# EAGLE design Atlas (EAGLE 9.2.2)
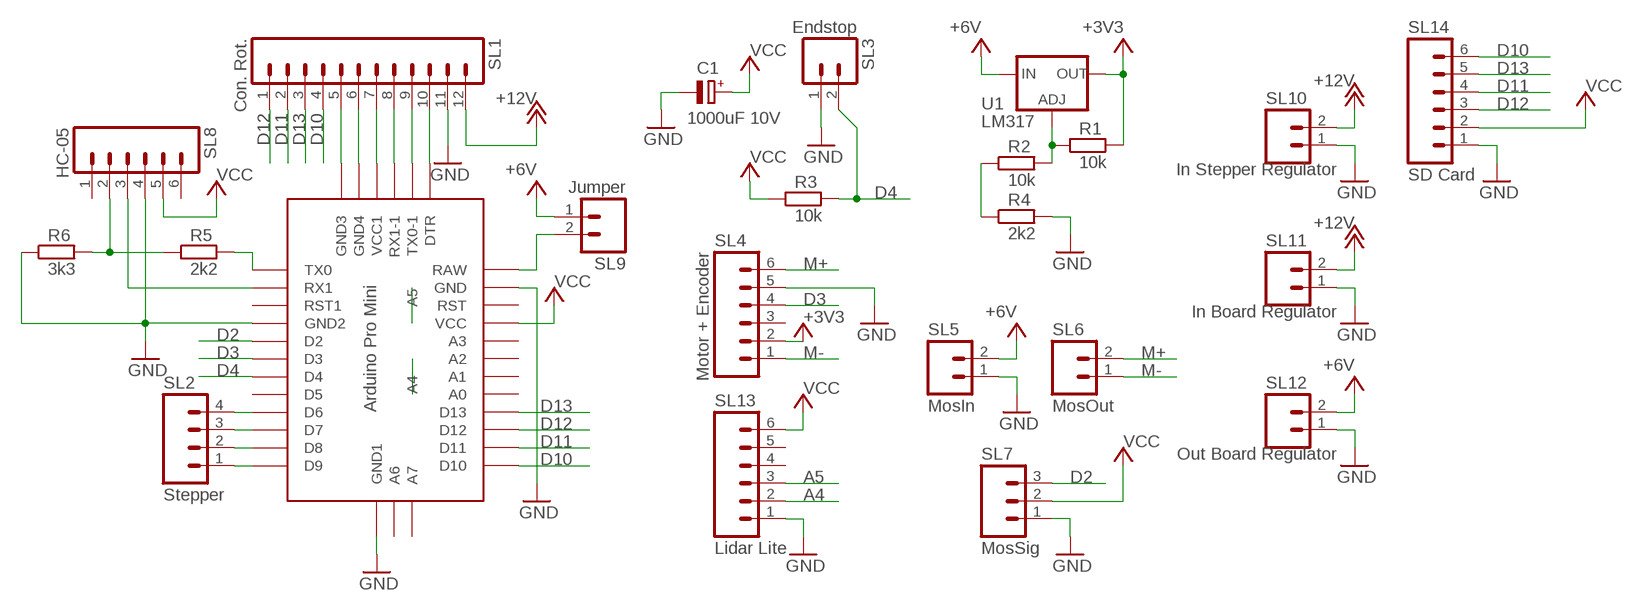
[diagram p0: schematic, sheet 1]

## Parts
C1  1000uF 10V  CPOL-EUE5-10.5  [E5-10,5]
R1  10k  R-EU_0207/10  [0207/10]
R2  10k  R-EU_0207/10  [0207/10]
R3  10k  R-EU_0207/10  [0207/10]
R4  2k2  R-EU_0207/10  [0207/10]
R5  2k2  R-EU_0207/10  [0207/10]
R6  3k3  R-EU_0207/10  [0207/10]
SL1  Con. Rot.  M12  [12P]
SL2  Stepper  M04  [04P]
SL3  Endstop  M02  [02P]
SL4  Motor + Encoder  M06  [06P]
SL5  MosIn  M02  [02P]
SL6  MosOut  M02  [02P]
SL7  MosSig  M03  [03P]
SL8  HC-05  M06  [06P]
SL9  Jumper  M02  [02P]
SL10  In Stepper Regulator  M02  [02P]
SL11  In Board Regulator  M02  [02P]
SL12  Out Board Regulator  M02  [02P]
SL13  Lidar Lite  M06  [06P]
SL14  SD Card  M06  [06P]
U1  LM317  V_REG_317SINK  [TO220-ADJ]
U$1  ABK-PRO-MINI  [ABK-PRO-MINI]

## Nets
+3V3: R1.2 SL4.2 U1.OUT
+6V: SL5.2 SL9.1 SL12.2 U1.IN
+12V: SL1.12 SL10.2 SL11.2
A4: SL13.2 U$1.A4
A5: SL13.3 U$1.A5
D2: SL7.3 U$1.D2
D3: SL4.4 U$1.D3
D4: R3.2 SL3.2 U$1.D4
D10: SL1.4 SL14.6 U$1.D10
D11: SL1.2 SL14.4 U$1.D11
D12: SL1.1 SL14.3 U$1.D12
D13: SL1.3 SL14.5 U$1.D13
DTR: SL1.10 U$1.DTR
GND: C1.- R4.2 R6.1 SL1.5 SL1.6 SL1.11 SL3.1 SL4.5 SL5.1 SL7.1 SL8.4 SL10.1 SL11.1 SL12.1 SL13.1 SL14.1 U$1.GND U$1.GND1(GND2) U$1.GND2(GND3) U$1.GND3(GND4) U$1.GND4(GND1)
M+: SL4.6 SL6.2
M-: SL4.1 SL6.1
N$1: R5.2 U$1.TX0
N$2: SL9.2 U$1.RAW
N$7: R2.1 R4.1
N$8: R5.1 R6.2 SL8.2
N$9: R1.1 R2.2 U1.ADJ
N$10: SL8.3 U$1.RX1
N$12: SL2.1 U$1.D9
N$13: SL2.2 U$1.D8
N$14: SL2.3 U$1.D7
N$15: SL2.4 U$1.D6
RX1: SL1.8 U$1.RX1-1
TX0: SL1.9 U$1.TX0-1
VCC: C1.+ R3.1 SL1.7 SL7.2 SL8.5 SL13.6 SL14.2 U$1.VCC U$1.VCC1
Unconnected: SL4.3 SL8.1 SL8.6 SL13.4 SL13.5 U$1.A0 U$1.A1 U$1.A2 U$1.A3 U$1.A6 U$1.A7 U$1.D5 U$1.RST U$1.RST1

## Library data of the parts
C1 = resistor:CPOL-EU: POLARIZED CAPACITOR, European symbol
R1-R6 = resistor:R-EU_: RESISTOR, European symbol
SL1 = con-amp-quick:M12: AMP QUICK CONNECTOR; OC_FARNELL: unknown; OC_NEWARK: unknown
SL2 = con-amp-quick:M04: AMP QUICK CONNECTOR; OC_FARNELL: unknown; OC_NEWARK: unknown
SL3 SL5 SL6 SL9-SL12 = con-amp-quick:M02: AMP QUICK CONNECTOR; OC_FARNELL: unknown; OC_NEWARK: unknown
SL4 SL8 SL13 SL14 = con-amp-quick:M06: AMP QUICK CONNECTOR; OC_FARNELL: unknown; OC_NEWARK: unknown
SL7 = con-amp-quick:M03: AMP QUICK CONNECTOR; OC_FARNELL: unknown; OC_NEWARK: unknown
U1 = SparkFun-IC-Power:V_REG_317: Voltage Regulator Standard LM317 adjustable voltage regulator. AOI (Adjust Output Input). Google 'LM317 Calculator' for easy to use app to get the two resistor values needed. 240/720 for 5V output. 240/390 for 3.3V output. Spark Fun Electronics SKU : COM-00527
U$1 = Arduino:ABK-PRO-MINI: ABK Pro-Mini Arduino Clone

## Board
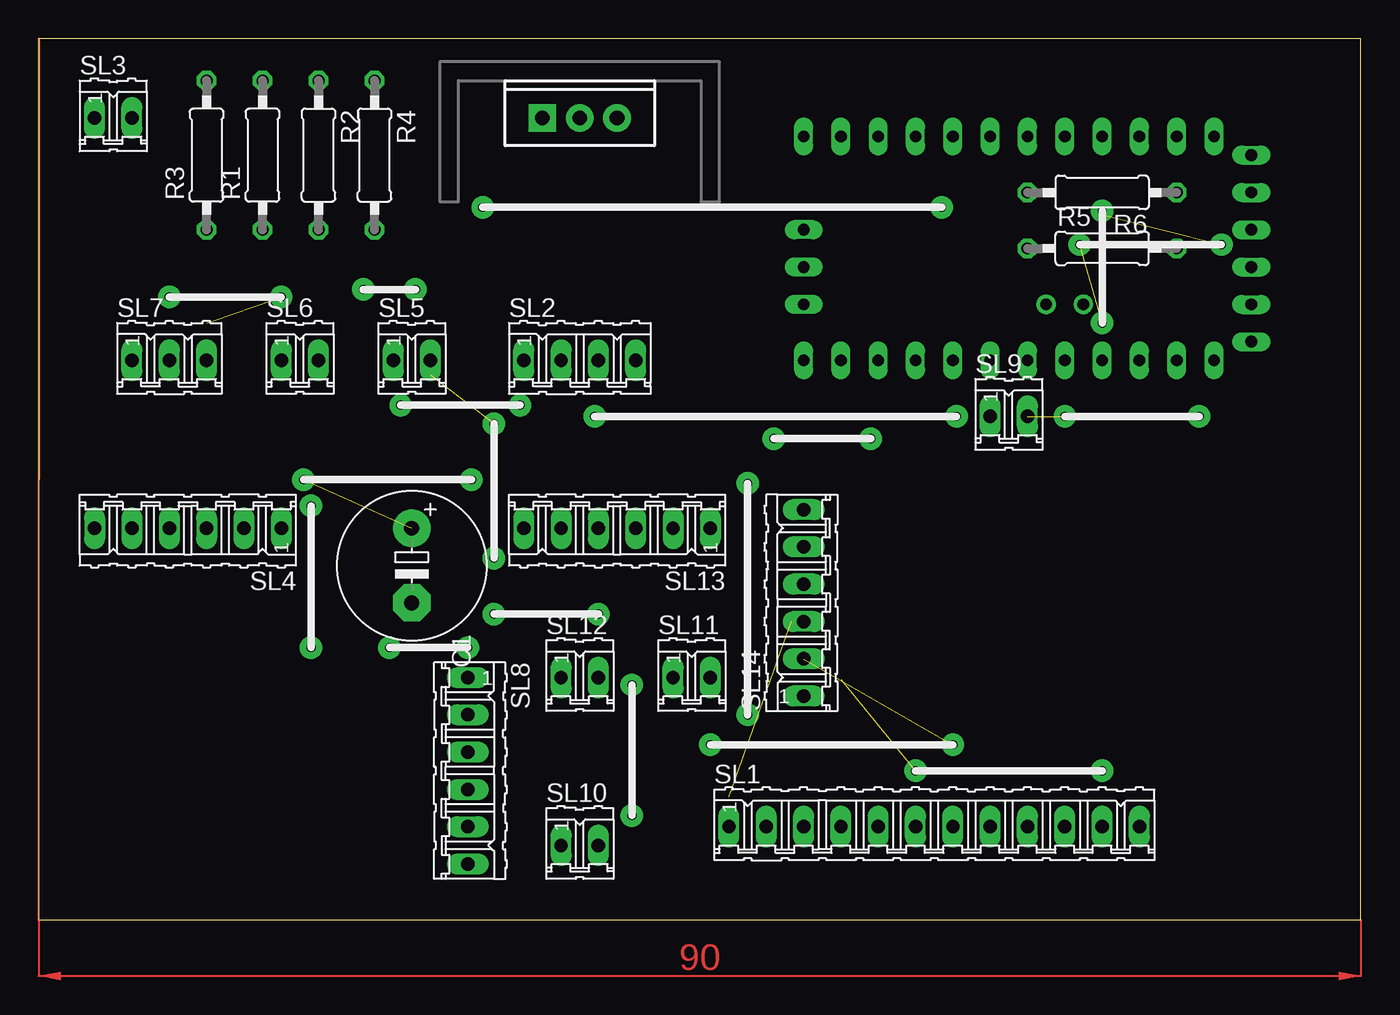
[diagram p1: board, top side]
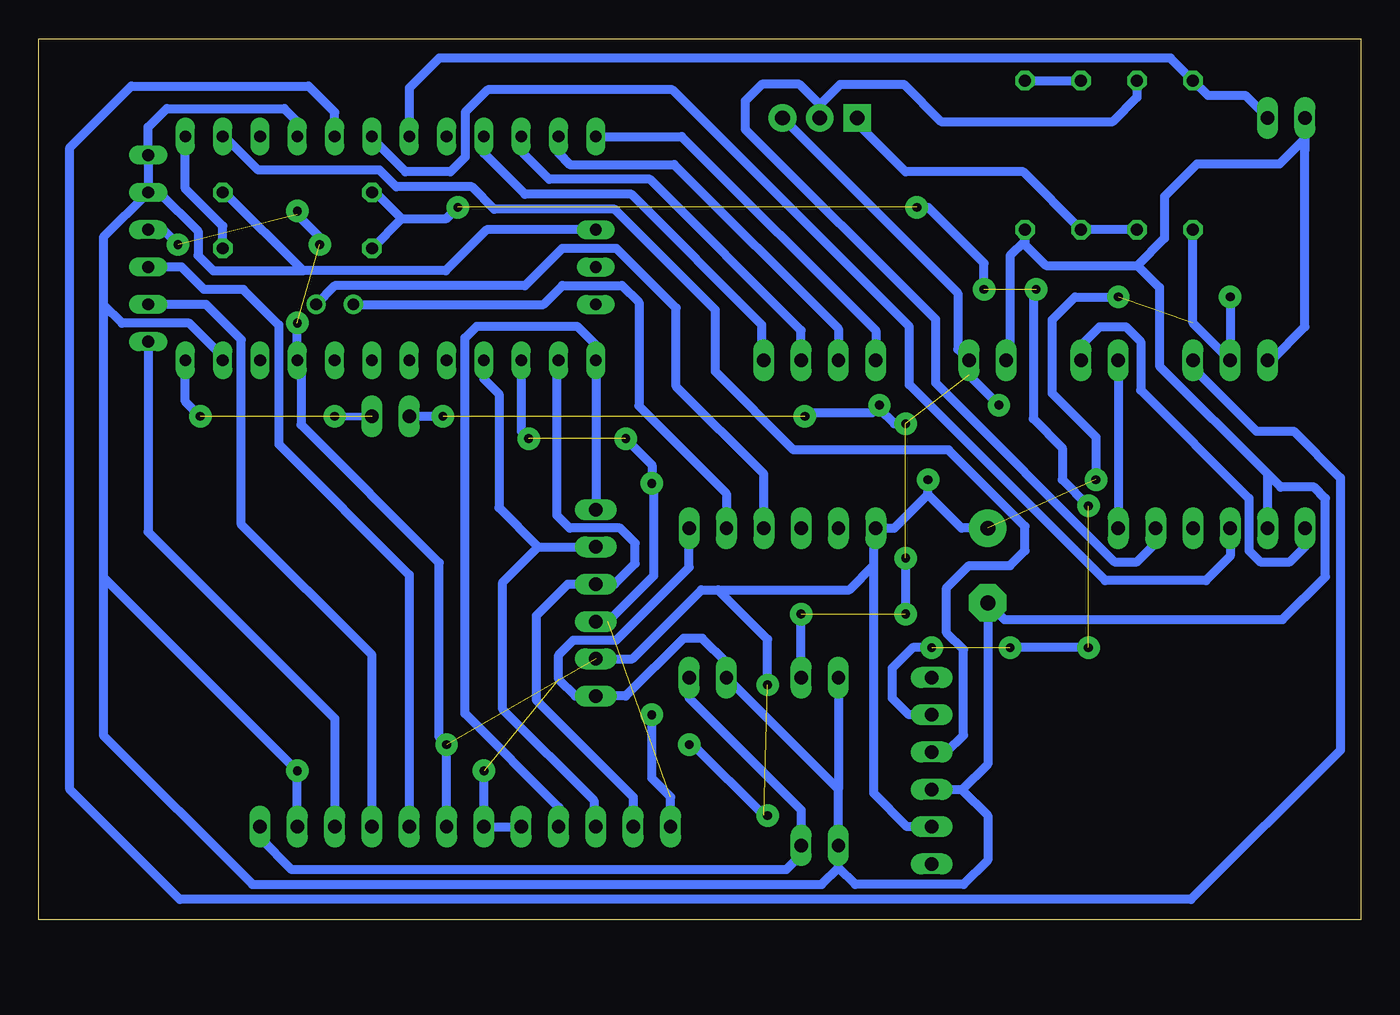
[diagram p2: board, bottom side, seen from below]

Size 90 x 60 mm. Coordinates in mm from the lower left corner, seen from the top.
Outline: 0,0 90,0 90,60 0,60 0,0
Copper layers (1*16): Top 0.035mm / dielectric 1.5mm / Bottom 0.035mm
Design rules "default *": minimum track width 20mil, minimum drill 0.35mm, track to track 10mil, track to pad 10mil, pad to pad 10mil, via to via 10mil, smd to smd 10mil, copper to edge 40mil, drill to drill 6mil, minimum pad ring 10mil, minimum via ring 8mil, stop-mask expansion 4mil, vias tented up to drill 0mil, thermal gap 10mil

### Footprints (pad centres in the part's own frame; a part is rotated, then mirrored left to right if it is on the bottom)
E5-10,5 = drill 1.016 pad 2.54: + -2.54,0 | drill 1.016 pad 2.54 octagon: - 2.54,0
0207/10 = drill 0.813 octagon: 1 -5.08,0; 2 5.08,0
12P = drill 0.914 long: 1 -13.97,0; 2 -11.43,0; 3 -8.89,0; 4 -6.35,0; 5 -3.81,0; 6 -1.27,0; 7 1.27,0; 8 3.81,0; 9 6.35,0; 10 8.89,0; 11 11.43,0; 12 13.97,0
04P = drill 0.914 long: 1 -3.81,0; 2 -1.27,0; 3 1.27,0; 4 3.81,0
02P = drill 0.914 long: 1 -1.27,0; 2 1.27,0
06P = drill 0.914 long: 1 -6.35,0; 2 -3.81,0; 3 -1.27,0; 4 1.27,0; 5 3.81,0; 6 6.35,0
03P = drill 0.914 long: 1 -2.54,0; 2 0,0; 3 2.54,0
TO220-ADJ = drill 1 pad 1.88 square: ADJ -2.54,0 | drill 1 pad 1.88: IN 2.54,0; OUT 0,0
ABK-PRO-MINI = drill 0.8 long: A0 10.16,-3.81; A1 10.16,-6.35; A2 10.16,-8.89; A3 10.16,-11.43; A6 3.81,-21.59; A7 6.35,-21.59; D2 -5.08,-3.81; D3 -5.08,-6.35; D4 -5.08,-8.89; D5 -5.08,-11.43; D6 -5.08,-13.97; D7 -5.08,-16.51; D8 -5.08,-19.05; D9 -5.08,-21.59; D10 10.16,-21.59; D11 10.16,-19.05; D12 10.16,-16.51; D13 10.16,-13.97; DTR 8.89,8.89; GND 10.16,3.81; GND1 -5.08,-1.27; GND2 -3.81,8.89; GND3 -1.27,8.89; GND4 1.27,-21.59; RAW 10.16,6.35; RST 10.16,1.27; RST1 -5.08,1.27; RX1 -5.08,3.81; RX1-1 3.81,8.89; TX0 -5.08,6.35; TX0-1 6.35,8.89; VCC 10.16,-1.27; VCC1 1.27,8.89 | drill 0.8: A4 6.35,-5.08; A5 6.35,-2.54

### Placement (x,y rotation side)
C1  25.4,24.13 270 top
R1  15.24,52.07 90 top
R2  19.05,52.07 270 top
R3  11.43,52.07 90 top
R4  22.86,52.07 270 top
R5  72.39,45.72 0 top
R6  72.39,49.53 180 top
SL1  60.96,6.35 0 top
SL2  36.83,38.1 0 top
SL3  5.08,54.61 0 top
SL4  10.16,26.67 180 top
SL5  25.4,38.1 0 top
SL6  17.78,38.1 0 top
SL7  8.89,38.1 0 top
SL8  29.21,10.16 270 top
SL9  66.04,34.29 0 top
SL10  36.83,5.08 0 top
SL11  44.45,16.51 0 top
SL12  36.83,16.51 0 top
SL13  39.37,26.67 180 top
SL14  52.07,21.59 90 top
U1  36.83,54.61 0 top
U$1  73.66,48.26 270 top

### Tracks (layer width: path | path; a pad name or v marks a point on that pad's centre or on a via)
+3V3
  Bottom 0.61: R1.2 15.24,56.01 16.89,54.36 28.57,54.36 31.11,56.9 35.43,56.9 36.83,55.5 | SL4.2 13.97,25.65 15.24,24.38 16.76,24.38 28.96,36.58 28.96,40.89 41.91,53.85 41.91,55.75 40.77,56.9 38.23,56.9 36.83,55.5 | U1.OUT 36.83,55.5
+6V  (via drill 0.6 pad 1.52)  (4 unrouted)
  Bottom 0.61: U1.IN 27.43,42.67 27.43,38.86 SL5.2 26.67,37.08 v24.64,35.05 | v30.99,33.78 31.75,33.78 32.77,34.8 v32.77,35.05 33.27,34.54 37.59,34.54 v37.85,34.29 | v30.99,24.64 v30.99,20.83 | SL12.2 v38.1,20.83 | v62.48,34.29 SL9.1
+12V
  Bottom 0.61: SL11.2 45.72,15.11 38.1,7.49 SL10.2 38.1,4.45 39.12,3.43 72.77,3.43 74.93,5.59 SL1.12
A4
  Bottom 0.61: U$1.A4 55.64,41.91 54.35,43.2 50.3,43.2 49.15,42.05 49.15,34.99 43.18,29.02 SL13.2
A5
  Bottom 0.61: U$1.A5 69.85,43.18 56.9,43.18 54.36,45.72 50.67,45.72 46.61,41.66 46.61,36.32 40.64,30.35 SL13.3
D2
  Bottom 0.61: U$1.D2 69.85,54.99 71.63,56.77 83.69,56.77 87.88,52.58 87.88,8.89 80.39,1.4 11.56,1.4 1.4,11.56 1.4,30.1 4.57,33.27 7.11,33.27 11.43,37.59 SL7.3
D3
  Bottom 0.61: U$1.D3 67.31,53.21 65.02,50.93 61.98,50.93 60.96,51.94 60.96,54.99 59.44,56.52 46.86,56.52 30.73,40.39 30.73,36.45 17.4,23.11 10.54,23.11 8.89,24.77 SL4.4
D4
  Bottom 0.61: U$1.D4 64.77,56.64 62.74,58.67 12.95,58.67 R3.2 10.41,56.13 7.87,56.13 SL3.2
D10
  Bottom 0.61: SL14.6 U$1.D10 52.07,39.13 53.37,40.42 60.17,40.42 60.98,39.62 60.98,14.05 54.61,7.68 SL1.4
D11
  Bottom 0.61: U$1.D11 54.74,37.97 54.74,27.56 53.85,26.67 50.42,26.67 49.4,25.65 49.4,24.26 50.8,22.86 SL14.4 53.98,22.86 56.13,20.7 56.13,14.99 49.53,8.38 SL1.2
D12  (via drill 0.6 pad 1.52)  (2 unrouted)
  Bottom 0.61: U$1.D12 57.15,33.27 v56.64,32.77 | v50.04,32.77 48.26,30.99 v48.26,29.72 48.13,29.59 48.13,23.43 51.25,20.32 SL14.3 | SL1.1 46.99,8.38 48.26,9.65 v48.26,13.97
D13
  Bottom 0.61: SL1.3 52.2,6.48 52.2,8.13 58.42,14.35 58.42,22.99 56.01,25.4 | U$1.D13 59.69,36.83 58.67,35.81 58.67,28.07 56.01,25.4 | 56.01,25.4 SL14.5
DTR
  Bottom 0.61: SL1.10 69.85,13.72 82.55,26.42 U$1.DTR
GND  (via drill 0.6 pad 1.52)  (1 unrouted)
  Bottom 0.61: 72.01,44.2 77.34,49.53 R6.1 | U$1.GND1 72.39,54.36 73.28,55.24 81.28,55.24 82.55,53.98 U$1.GND2 U$1.GND3 | 85.6,41.9 85.6,46.48 U$1.GND3 | 85.6,41.9 85.6,23.37 | 85.6,23.37 85.6,12.57 75.44,2.41 36.7,2.41 35.56,3.56 | SL3.1 3.81,40.39 6.1,38.1 SL7.1 | SL5.1 23.88,38.35 23.88,45.21 22.86,46.23 R4.2 22.86,45.97 21.44,44.55 15.21,44.55 | 6.35,30.35 13.72,37.72 13.72,43.05 15.21,44.55 | 6.35,30.35 5.46,29.46 3.17,29.46 2.41,28.7 2.41,23.37 5.33,20.45 24.26,20.45 C1.- 25.4,10.61 27.15,8.86 | SL12.1 35.56,8.89 | 35.56,8.89 SL11.1 43.18,17.53 44.83,19.18 46.1,19.18 50.04,15.24 SL14.1 53.47,15.24 54.61,16.38 54.61,18.03 53.59,19.05 50.67,19.05 45.72,24 SL13.1 | U$1.GND3 81.79,49.53 79.15,46.89 79.15,45.24 78.11,44.2 72.01,44.2 | SL1.5 SL1.6 v59.69,10.16 | SL1.11 v72.39,10.16 85.6,23.37 | 35.56,8.89 SL10.1 35.56,3.56 | 35.56,3.56 34.42,2.41 27.05,2.41 25.4,4.06 25.4,7.11 27.15,8.86 | SL8.4 27.18,8.89 27.15,8.86 | U$1.GND 77.47,38.35 79.74,40.62 84.32,40.62 85.6,41.9 | SL4.5 6.35,30.35 | SL3.1 3.81,52.43 | U$1.GND4 59.5,46.99 62.29,44.2 72.01,44.2 | 15.21,44.55 13.36,46.41 13.36,49.25 11.15,51.46 5.54,51.46 3.81,53.19 SL3.1
M+
  Bottom 0.61: SL4.6 3.81,25.4 4.83,24.38 6.86,24.38 7.62,25.15 7.62,28.7 14.99,36.07 14.99,39.37 16,40.39 17.78,40.39 19.05,39.12 SL6.2
M-
  Bottom 0.61: SL6.1 SL4.1
N$1
  Bottom 0.61: U$1.TX0 80.01,49.78 77.47,47.24 R5.2
N$2  (via drill 0.6 pad 1.52)  (2 unrouted)
  Bottom 0.508: SL9.2 v69.85,34.29
  Bottom 0.61: U$1.RAW 80.01,35.31 v78.99,34.29
N$7
  Bottom 0.61: R4.1 R2.1
N$8  (via drill 0.6 pad 1.52)  (4 unrouted)
  Bottom 0.61: R6.2 67.06,49.53 65.28,47.75 | v18.54,18.54 v23.88,18.54 | v29.21,18.54 30.5,18.54 31.9,17.14 31.9,15.12 30.76,13.97 SL8.2 | v25.65,42.93 25.65,44.7 29.46,48.51 v30.23,48.51 | R5.1 65.28,47.75 | 65.28,47.75 62.23,47.75 v61.47,48.51 | v18.54,28.19 20.32,29.97 20.32,32.14 22.3,34.13 22.3,42.72 v22.1,42.93
N$9
  Bottom 0.61: U1.ADJ 34.29,54.23 30.99,50.93 22.99,50.93 R2.2 R1.1
N$10
  Bottom 0.61: U$1.RX1 77.34,53.34 75.06,51.05 66.8,51.05 65.66,49.91 60.51,49.91 58.99,48.39 50.8,48.39 43.94,41.53 43.94,37.34 38.61,32 28.07,32 22.86,26.8 22.86,25.15 23.88,24.13 26.67,24.13 28.19,22.61 28.19,19.56 27.05,18.41 27.05,12.57 28.19,11.43 SL8.3
N$12
  Bottom 0.61: U$1.D9 46.23,53.34 33.02,40.13 SL2.1
N$13
  Bottom 0.61: U$1.D8 54.61,52.2 53.85,51.44 46.74,51.44 35.56,40.26 SL2.2
N$14
  Bottom 0.61: U$1.D7 57.15,52.32 55.24,50.42 48.39,50.42 38.1,40.13 SL2.3
N$15
  Bottom 0.61: U$1.D6 59.69,52.2 56.9,49.4 49.66,49.4 40.77,40.51 40.77,38.1 SL2.4
RX1
  Bottom 0.61: U$1.RX1-1 80.26,44.45 78.74,42.93 76.07,42.93 73.66,40.51 73.66,32.38 64.77,23.5 SL1.8
TX0
  Bottom 0.61: U$1.TX0-1 78.61,41.91 76.2,39.5 76.2,26.92 67.31,18.03 SL1.9
VCC  (via drill 0.6 pad 1.52)  (6 unrouted)
  Bottom 0.61: R3.1 11.43,40.64 SL7.2 v8.89,42.42 | SL8.5 30.88,6.35 33.17,8.64 33.17,24.13 | 33.17,24.13 33.17,26.52 SL13.6 31.75,26.67 29.46,28.96 | SL14.2 49.59,17.78 44.89,22.48 43.75,22.48 | 33.17,24.13 34.82,22.48 43.75,22.48 | 43.75,22.48 40.39,19.11 v40.39,16 | v72.39,40.64 U$1.VCC 72.14,37.85 72.14,33.72 62.74,24.32 62.74,12.45 v62.23,11.94 SL1.7 | v80.52,45.97 81.53,46.99 U$1.VCC1 | v70.87,45.97 70.87,46.48 72.39,48.01 v72.39,48.26 | v16.51,42.42 19.45,42.42 21.03,40.84 21.03,35.87 18.03,32.87 v18.03,29.97 | 29.46,28.96 v29.46,29.97 | C1.+ 27.18,26.67 29.46,28.96 | v40.39,7.11 40.64,7.11 45.47,11.94 v45.72,11.94
(copper drawn outside any net)
  shapes: Top area x2